# Altium project 超级电容.PrjPcb
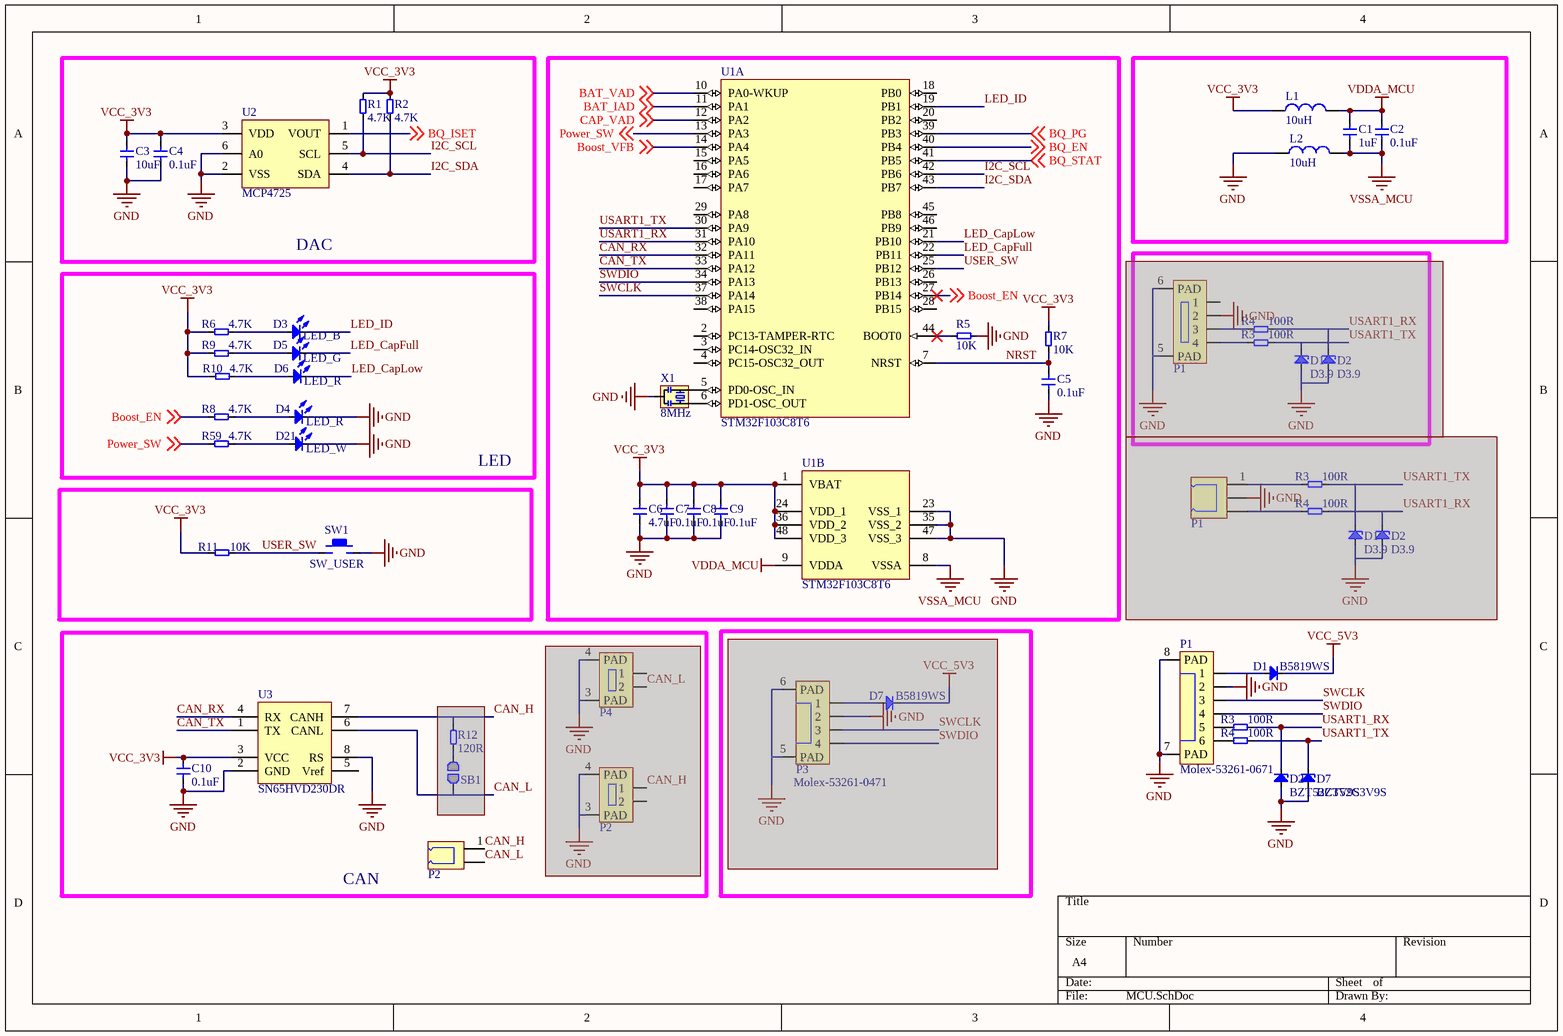
[diagram p0: MCU.SchDoc]
5 sheets, 188 parts. Net scope: global (net labels, ports and power ports of the same name join across sheets).
Board file: SCCM.PcbDoc
Sheets:
  MCU.SchDoc
  Power.SchDoc
  Buck.SchDoc
  PowerPath.SchDoc
  Boost.SchDoc

## Sheet MCU.SchDoc
size A4

### Parts
(Parts that share a designator on the sheet are numbered #1, #2 ... from top to bottom, then left to right.)
C1  1uF  [CAP-0603-L]
C2  0.1uF  [CAP-0603-L]
C3  10uF  [CAP-0805-L]
C4  0.1uF  [CAP-0603-L]
C5  0.1uF  [CAP-0603-L]
C6  4.7uF  [CAP-0603-L]
C7  0.1uF  [CAP-0603-L]
C8  0.1uF  [CAP-0603-L]
C9  0.1uF  [CAP-0603-L]
C10  0.1uF  [CAP-0603-L]
D1#1  D3.9  [SOD_323]  (masked out: inside a compile mask, not in the netlist)
D1#2  D3.9  [SOD_323]  (masked out: inside a compile mask, not in the netlist)
D1#3  B5819WS  [SOD_323]
D2#1  D3.9  [SOD_323]  (masked out: inside a compile mask, not in the netlist)
D2#2  D3.9  [SOD_323]  (masked out: inside a compile mask, not in the netlist)
D2#3  BZT52C3V9S  [SOD_323]
D3  LED_B  [LED_0603-L]
D4  LED_R  [LED_0603-L]
D5  LED_G  [LED_0603-L]
D6  LED_R  [LED_0603-L]
D7#1  B5819WS  [SOD_323]  (masked out: inside a compile mask, not in the netlist)
D7#2  BZT52C3V9S  [SOD_323]
D21  LED_W  [LED_0603-L]
L1  10uH  [L-0603-L]
L2  10uH  [L-0603-L]
P1#1  GH04  [SM04B-GHS-TB]  (value not drawn)  (masked out: inside a compile mask, not in the netlist)
P1#2  XH_3  [XH_3-sleep]  (value not drawn)  (masked out: inside a compile mask, not in the netlist)
P1#3  Molex-53261-0671  [Molex-53261-0671]
P2#1  GH02  [SM02B-GHS-TB]  (value not drawn)  (masked out: inside a compile mask, not in the netlist)
P2#2  XH_2  [XH_2-SLEEP]  (value not drawn)
P3  Molex-53261-0471  [Molex-53261-0471]  (masked out: inside a compile mask, not in the netlist)
P4  GH02  [SM02B-GHS-TB]  (value not drawn)  (masked out: inside a compile mask, not in the netlist)
R1  4.7K  [R-0603-L]
R2  4.7K  [R-0603-L]
R3#1  100R  [R-0603-L]  (masked out: inside a compile mask, not in the netlist)
R3#2  100R  [R-0603-L]  (masked out: inside a compile mask, not in the netlist)
R3#3  100R  [R-0603-L]
R4#1  100R  [R-0603-L]  (masked out: inside a compile mask, not in the netlist)
R4#2  100R  [R-0603-L]  (masked out: inside a compile mask, not in the netlist)
R4#3  100R  [R-0603-L]
R5  10K  [R-0603-L]
R6  4.7K  [R-0603-L]
R7  10K  [R-0603-L]
R8  4.7K  [R-0603-L]
R9  4.7K  [R-0603-L]
R10  4.7K  [R-0603-L]
R11  10K  [R-0603-L]
R12#1  120R  [R-0603-L]  (masked out: inside a compile mask, not in the netlist)
R59  4.7K  [R-0603-L]
SB1  Solderbridge  [Solderbridge-0603]  (value not drawn)  (no BOM)  (masked out: inside a compile mask, not in the netlist)
SW1  SW_USER  [KEY-4P-4.2*3.4*2.5]
U1  STM32F103C8T6  [STM-LQFP48_N]  (parts A,B of 2)
U2  MCP4725  [SOT-23-6]
U3  SN65HVD230DR  [SOIC_8]
X1  8MHz  [CSTCE_G(A)村田晶振]

### Blocks framed on the sheet
DAC: C3 C4 R1 R2 U2
LED: D3-D6 D21 R6 R8-R10 R59
CAN: C10 P2#1 P2#2 P4 R12#1 SB1 U3

### Nets
GND: C3.1 C4.1 C5.1 C6.1 C7.1 C8.1 C9.1 C10.1 D2#3.1 D4.2 D7#2.1 D21.2 L2.1 P1#3.2 P1#3.7(PAD) P1#3.8(PAD) R5.2 SW1.1 U1.23(VSS_1) U1.35(VSS_2) U1.47(VSS_3) U2.2(VSS) U2.6(A0) U3.2(GND) U3.8(RS) X1.2(GND)
VCC_3V3: C3.2 C4.2 C6.2 C7.2 C8.2 C9.2 C10.2 L1.1 R1.2 R2.2 R6.1 R7.2 R9.1 R10.1 R11.1 U1.1(VBAT) U1.24(VDD_1) U1.36(VDD_2) U1.48(VDD_3) U2.3(VDD) U3.3(VCC)
VCC_5V3: D1#3.2
VDDA_MCU: C1.2 C2.2 L1.2 U1.9(VDDA)
VSSA_MCU: C1.1 C2.1 L2.2 U1.8(VSSA)
BAT_IAD: U1.11(PA1) ; off-sheet BAT_IAD
BAT_VAD: U1.10(PA0-WKUP) ; off-sheet BAT_VAD
Boost_EN: R8.1 U1.27(PB14) ; off-sheet Boost_EN
Boost_VFB: U1.14(PA4) ; off-sheet Boost_VFB  [project net LM_VFB]
BQ_EN: U1.40(PB4) ; off-sheet BQ_EN
BQ_ISET: U2.1(VOUT) ; off-sheet BQ_ISET
BQ_PG: U1.39(PB3) ; off-sheet BQ_PG
BQ_STAT: U1.41(PB5) ; off-sheet BQ_STAT
CAN_H: P2#2.1 U3.7(CANH)
CAN_L: P2#2.2 U3.6(CANL)
CAN_RX: U1.32(PA11) U3.4(RX)
CAN_TX: U1.33(PA12) U3.1(TX)
CAP_VAD: U1.12(PA2) ; off-sheet CAP_VAD
I2C_SCL: R1.1 U1.42(PB6) U2.5(SCL)
I2C_SDA: R2.1 U1.43(PB7) U2.4(SDA)
LED_CapFull: D5.2 U1.22(PB11)
LED_CapLow: D6.2 U1.21(PB10)
LED_ID: D3.2 U1.19(PB1)
NRST: C5.2 R7.1 U1.7(NRST)
Power_SW: R59.1 U1.13(PA3) ; off-sheet Power_SW
SWCLK: P1#3.3 U1.37(PA14)
SWDIO: P1#3.4 U1.34(PA13)
USART1_RX: D2#3.2 R3#3.2 U1.31(PA10)
USART1_TX: D7#2.2 R4#3.2 U1.30(PA9)
USER_SW: R11.2 SW1.2 U1.25(PB12)
NetD1#3_1: D1#3.1 P1#3.1
NetD3_1: D3.1 R6.2
NetD4_1: D4.1 R8.2
NetD5_1: D5.1 R9.2
NetD6_1: D6.1 R10.2
NetD21_1: D21.1 R59.2
NetP1#3_5: P1#3.5 R3#3.1
NetP1#3_6: P1#3.6 R4#3.1
NetR5_1: R5.1 U1.44(BOOT0)
NetU1_5: U1.5(PD0-OSC_IN) X1.1(OSC1)
NetU1_6: U1.6(PD1-OSC_OUT) X1.3(OSC2)

Not connected (* = marked no-connect by the designer): U1 2(PC13-TAMPER-RTC) 3(PC14-OSC32_IN) 4(PC15-OSC32_OUT) 15(PA5) 16(PA6) 17(PA7) 18(PB0) 20(PB2) 26(PB13) 28(PB15) 29(PA8) 38(PA15) 45(PB8) 46(PB9); U3 5(Vref)

### Library data of the parts
C1-C10 = CAP
D1#1 D1#2 D2#1-D2#3 D7#2 = Diode_ZD
D1#3 D7#1 = Diode
D3-D6 D21 = LED
L1 L2 = Inductor: 电感
P1#1 = GHS-M04B: 04GH座
P1#3 = Molex-53261-0671: 1.25mm Pitch PicoBlade Header
P2#1 P4 = GHS-M02B: 02GH座
P3 = Molex-53261-0471: 1.25mm Pitch PicoBlade Header
R1 R2 R3#1-R3#3 R4#1-R4#3 R5-R11 R12#1 R59 = Res
SW1 = KEY
U1 = STM32F103C8T6: ARM Cortex-M3 32-bit MCU, 64 KB Flash, 20 KB Internal RAM, 37 I/Os, 48-pin LQFP, -40 to 85 degC, Tray; A/D Converter: 2x12-bit (10 Channel); FLASH Size (Prog) (kB): 64; I/Os (High Current): 37; Internal RAM Size (kB): 20; Operating Frequency(F) (Processor speed) (MHz): 72; Supply Voltage(Vcc) min (V): 2; DatasheetVersion: Rev. 16; PackageVersion: Rev. 6, 06/2013; PackageReference: LQFP48; PackageDescription: 48-Pin Low Profile Quad Flat Package, 7 x 7 mm Body, 0.5 mm Pitch; Supplier 1: Digi-Key; Supplier Part Number 1: 497-6063-ND; Supplier 2: Farnell; Supplier Part Number 2: 1447637; Supplier 3: Newark; Supplier Part Number 3: 59M2182; Supplier 4: Newark; Supplier Part Number 4: 57P1222; Supplier 5: Mouser; Supplier Part Number 5: 511-STM32F103C8T6; Core: ARM Cortex-M3; Packing: Tray; Mounting Technology: Surface Mount; PartNumber: STM32F103C8T6; ComponentLink1Description: Manufacturer URL; ComponentLink1URL: http://www.st.com/web/en/home.html; ComponentLink2Description: Datasheet; ComponentLink2URL: http://www.st.com/st-web-ui/static/active/en/resource/technical/document/datasheet/CD00161566.pdf; ComponentLink3Description: Package Specification; ComponentLink3URL: http://www.st.com/st-web-ui/static/active/en/resource/technical/document/datasheet/DM00058181.pdf
U2 = MCP4725: I2C 12bit DAC
U3 = SN65HVD230DR: CAN芯片
X1 = XTAL-3215
SB1 = Solderbridge: Value: Solderbridge

## Sheet Power.SchDoc
size A4
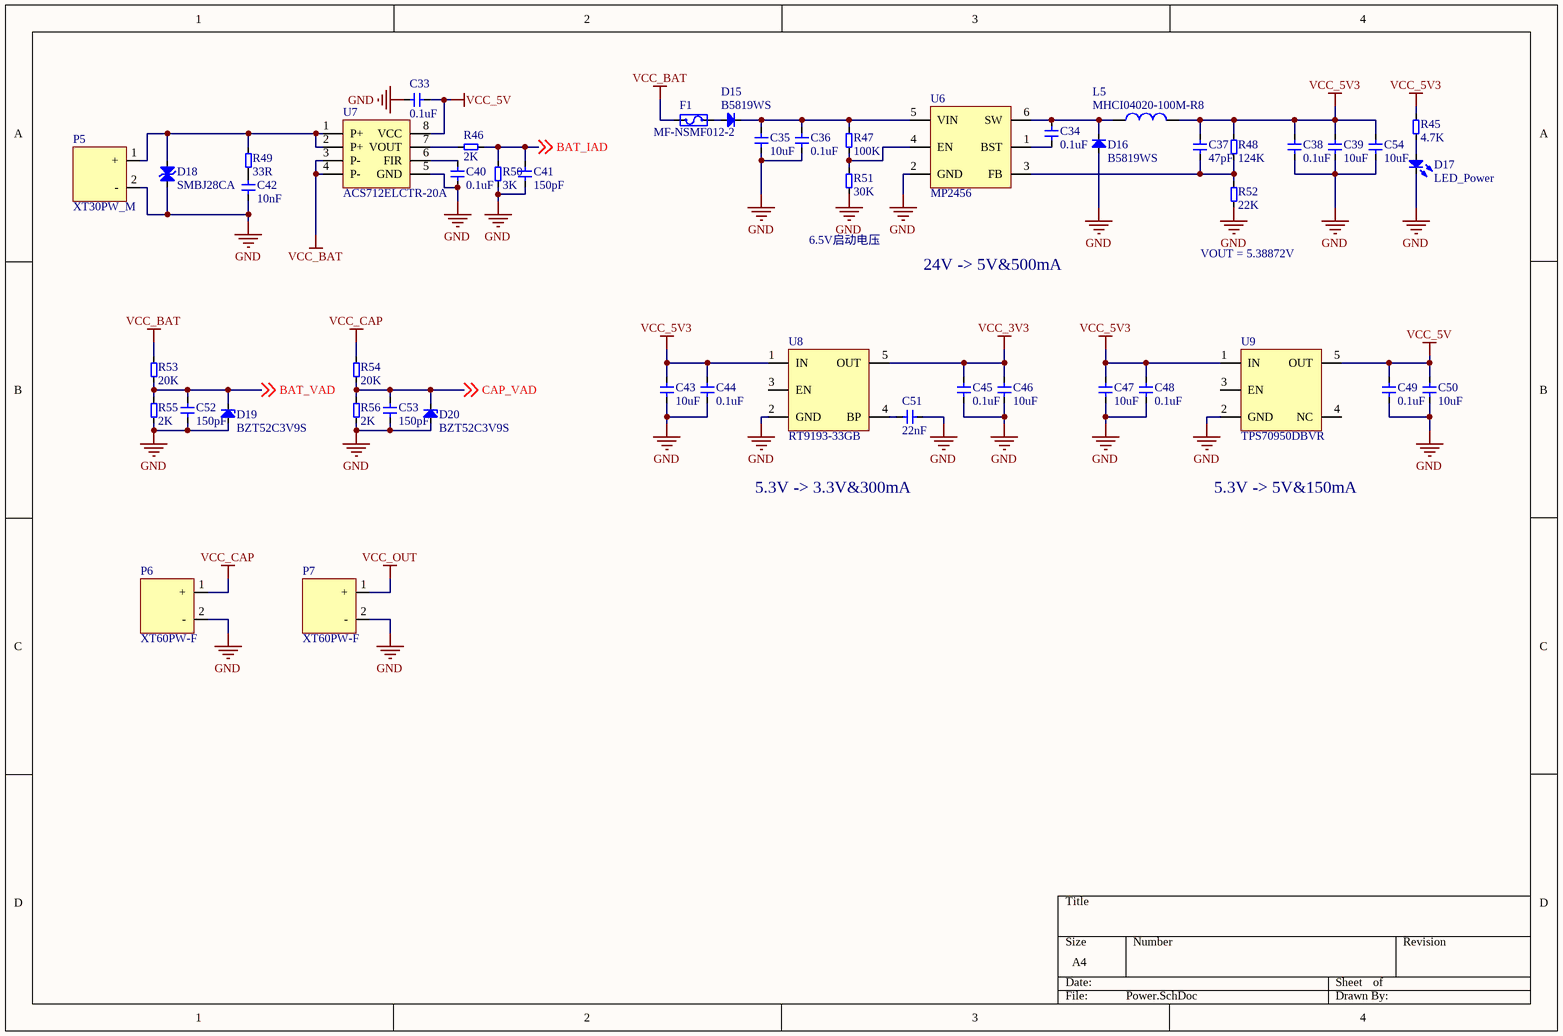
[diagram p1: Power.SchDoc]

### Parts
C33  0.1uF  [CAP-0603-L]
C34  0.1uF  [CAP-0603-L]
C35  10uF  [CAP-0805-L]
C36  0.1uF  [CAP-0603-L]
C37  47pF  [CAP-0603-L]
C38  0.1uF  [CAP-0603-L]
C39  10uF  [CAP-0805-L]
C40  0.1uF  [CAP-0603-L]
C41  150pF  [CAP-0603-L]
C42  10nF  [CAP-0805-L]
C43  10uF  [CAP-0805-L]
C44  0.1uF  [CAP-0603-L]
C45  0.1uF  [CAP-0603-L]
C46  10uF  [CAP-0805-L]
C47  10uF  [CAP-0805-L]
C48  0.1uF  [CAP-0603-L]
C49  0.1uF  [CAP-0603-L]
C50  10uF  [CAP-0805-L]
C51  22nF  [CAP-0603-L]
C52  150pF  [CAP-0603-L]
C53  150pF  [CAP-0603-L]
C54  10uF  [CAP-0805-L]
D15  B5819WS  [SOD_323]
D16  B5819WS  [SOD_323]
D17  LED_Power  [LED_0603-L]
D18  SMBJ28CA  [Diode_SMA]
D19  BZT52C3V9S  [SOD_323]
D20  BZT52C3V9S  [SOD_323]
F1  MF-NSMF012-2  [FUSE_1206]
L5  MHCI04020-100M-R8  [L-0420]
P5  XT30PW_M  [XT30PW-M]
P6  XT60PW-F  [XT60PW-M]
P7  XT60PW-F  [XT60PW-F]
R45  4.7K  [R-0603-L]
R46  2K  [R-0603-L]
R47  100K  [R-0603-L]
R48  124K  [R-0603-L]
R49  33R  [R-0805-L]
R50  3K  [R-0603-L]
R51  30K  [R-0603-L]
R52  22K  [R-0603-L]
R53  20K  [R-0603-L]
R54  20K  [R-0603-L]
R55  2K  [R-0603-L]
R56  2K  [R-0603-L]
U6  MP2456  [SOT-23-6]
U7  ACS712ELCTR-20A  [SOIC_8]
U8  RT9193-33GB  [SOT-23-5]
U9  TPS70950DBVR  [SOT-23-5]

### Nets
GND: C33.2 C35.1 C36.1 C38.1 C39.1 C40.1 C41.1 C42.1 C43.1 C44.1 C45.1 C46.1 C47.1 C48.1 C49.1 C50.1 C51.1 C52.1 C53.1 C54.1 D16.1 D17.2 D18.1 D19.1 D20.1 P5.2(-) P6.2(-) P7.2(-) R50.1 R51.1 R52.1 R55.1 R56.1 U6.2(GND) U7.5(GND) U8.2(GND) U9.2(GND)
VCC_3V3: C45.2 C46.2 U8.5(OUT)
VCC_5V: C33.1 C49.2 C50.2 U7.8(VCC) U9.5(OUT)
VCC_5V3: C37.2 C38.2 C39.2 C43.2 C44.2 C47.2 C48.2 C54.2 L5.2 R45.2 R48.2 U8.1(IN) U9.1(IN)
VCC_BAT: F1.1 R53.2 U7.3(P-) U7.4(P-)
VCC_CAP: P6.1(+) R54.2
VCC_OUT: P7.1(+)
BAT_IAD: C41.2 R46.1 R50.2 ; off-sheet BAT_IAD
BAT_VAD: C52.2 D19.2 R53.1 R55.2 ; off-sheet BAT_VAD
CAP_VAD: C53.2 D20.2 R54.1 R56.2 ; off-sheet CAP_VAD
NetC34_1: C34.1 U6.1(BST)
NetC34_2: C34.2 D16.2 L5.1 U6.6(SW)
NetC35_2: C35.2 C36.2 D15.2 R47.2 U6.5(VIN)
NetC37_1: C37.1 R48.1 R52.2 U6.3(FB)
NetC40_2: C40.2 U7.6(FIR)
NetC42_2: C42.2 R49.1
NetC51_2: C51.2 U8.4(BP)
NetD15_1: D15.1 F1.2
NetD17_1: D17.1 R45.1
NetD18_2: D18.2 P5.1(+) R49.2 U7.1(P+) U7.2(P+)
NetR46_2: R46.2 U7.7(VOUT)
NetR47_1: R47.1 R51.2 U6.4(EN)

Not connected (* = marked no-connect by the designer): U8 3(EN); U9 3(EN) 4(NC)

### Notes on the sheet
- (near R51) 6.5V启动电压
- 24V -> 5V&500mA
- (near R52) VOUT = 5.38872V
- 5.3V -> 3.3V&300mA
- 5.3V -> 5V&150mA

### Library data of the parts
C33-C54 = CAP
D15 D16 = Diode
D17 = LED
D18 = TVS_C
D19 D20 = Diode_ZD
F1 = Fuse
L5 = Inductor: 电感
P5 = XT30
P6 P7 = XT60
R45-R56 = Res
U7 = ACS712ELCTR: 电流测量芯片
U8 = RT9193: LDO
U9 = TPS709: 具有使能端的 150-mA 超低 Iq LDO

## Sheet Buck.SchDoc
size A4
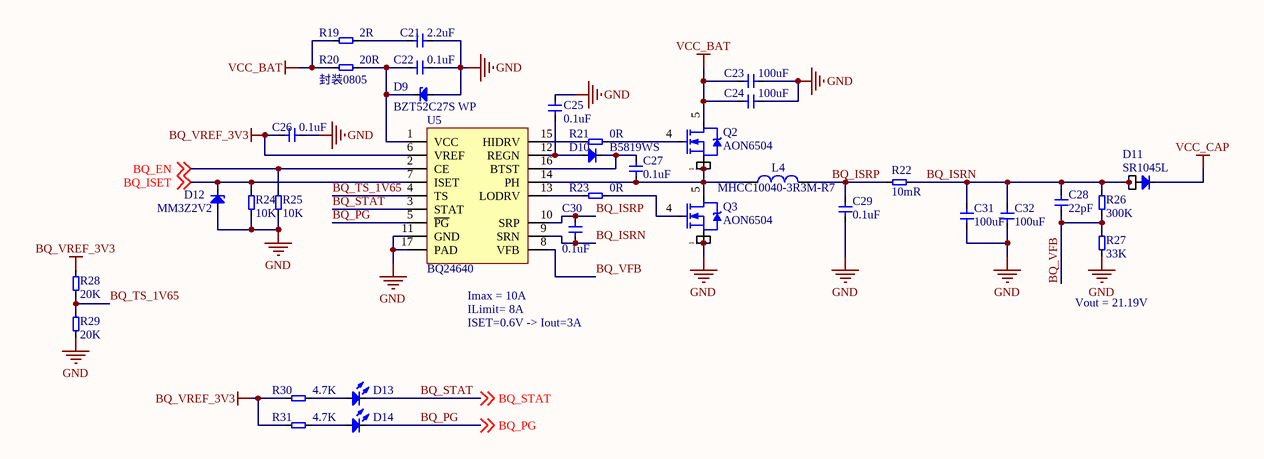
[diagram p2: Buck.SchDoc]

### Parts
C21  2.2uF  [CAP-0603-L]
C22  0.1uF  [CAP-0603-L]
C23  100uF  [CAP-1206-L]
C24  100uF  [CAP-1206-L]
C25  0.1uF  [CAP-0603-L]
C26  0.1uF  [CAP-0603-L]
C27  0.1uF  [CAP-0603-L]
C28  22pF  [CAP-0603-L]
C29  0.1uF  [CAP-0603-L]
C30  0.1uF  [CAP-0603-L]
C31  100uF  [CAP-1206-L]
C32  100uF  [CAP-1206-L]
D9  BZT52C27S WP  [SOD_323]
D10  B5819WS  [SOD_323]
D11  SR1045L  [PowerDi-5]
D12  MM3Z2V2  [SOD_323]
D13  LED_B  [LED_0603-L]  (value not drawn)
D14  LED_G  [LED_0603-L]  (value not drawn)
L4  MHCC10040-3R3M-R7  [L-10040]
Q2  AON6504  [DFN5x6]
Q3  AON6504  [DFN5x6]
R19  2R  [R-0603-L]
R20  20R  [R-0805-L]
R21  0R  [R-0603-L]
R22  10mR  [R-2512-SMALL]
R23  0R  [R-0603-L]
R24  10K  [R-0603-L]
R25  10K  [R-0603-L]
R26  300K  [R-0603-L]
R27  33K  [R-0603-L]
R28  20K  [R-0603-L]
R29  20K  [R-0603-L]
R30  4.7K  [R-0603-L]
R31  4.7K  [R-0603-L]
U5  BQ24640  [VQFN16N]

### Nets
BQ_VREF_3V3: C26.1 R28.2 R30.1 R31.1 U5.6(VREF)
GND: C21.2 C22.2 C23.1 C24.1 C25.2 C26.2 C29.1 C31.1 C32.1 D9.1 D12.1 Q3.1(S) Q3.2(S) Q3.3(S) R24.1 R25.1 R27.1 R29.1 U5.11(GND) U5.17(PAD)
VCC_BAT: C23.2 C24.2 Q2.5(D) R19.1 R20.1
VCC_CAP: D11.3
BQ_EN: R25.2 U5.2(CE) ; off-sheet BQ_EN
BQ_ISET: D12.2 R24.2 U5.7(ISET) ; off-sheet BQ_ISET
BQ_ISRN: C28.2 C30.1 C31.2 C32.2 D11.1 D11.2 R22.2 R26.2 U5.9(SRN)
BQ_ISRP: C29.2 C30.2 L4.2 R22.1 U5.10(SRP)
BQ_PG: D14.2 U5.5(~{PG}) ; off-sheet BQ_PG
BQ_STAT: D13.2 U5.3(STAT) ; off-sheet BQ_STAT
BQ_TS_1V65: R28.1 R29.2 U5.4(TS)
BQ_VFB: C28.1 R26.1 R27.2 U5.8(VFB)
NetC21_1: C21.1 R19.2
NetC22_1: C22.1 D9.2 R20.2 U5.1(VCC)
NetC25_1: C25.1 D10.1 U5.12(REGN)
NetC27_1: C27.1 L4.1 Q2.1(S) Q2.2(S) Q2.3(S) Q3.5(D) U5.14(PH)
NetC27_2: C27.2 D10.2 U5.16(BTST)
NetD13_1: D13.1 R30.2
NetD14_1: D14.1 R31.2
NetQ2_4: Q2.4(G) R21.2
NetQ3_4: Q3.4(G) R23.2
NetR21_1: R21.1 U5.15(HIDRV)
NetR23_1: R23.1 U5.13(LODRV)

### Notes on the sheet
- (near R20) 封装0805
- (near U5) Imax = 10A
- (near R27) Vout = 21.19V
- ILimit= 8A
- ISET=0.6V -> Iout=3A

### Library data of the parts
C21-C32 = CAP
D9 D12 = Diode_ZD
D10 = Diode
D11 = Diode_1
D13 D14 = LED
L4 = Inductor: 电感
Q2 Q3 = MOS-N_1
R19-R31 = Res
U5 = BQ24640: 用于超级电容器的高效同步开关模式电池充电控制器

## Sheet PowerPath.SchDoc
size A4
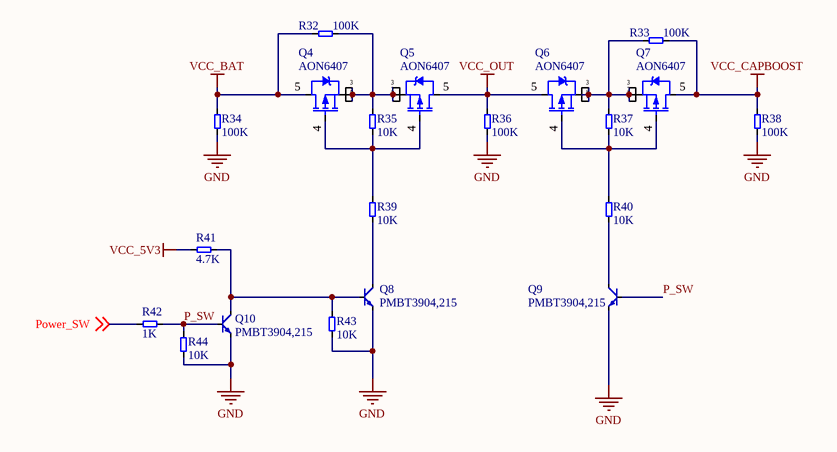
[diagram p3: PowerPath.SchDoc]

### Parts
Q4  AON6407  [DFN5x6]
Q5  AON6407  [DFN5x6]
Q6  AON6407  [DFN5x6]
Q7  AON6407  [DFN5x6]
Q8  PMBT3904,215  [SOT-23-3]
Q9  PMBT3904,215  [SOT-23-3]
Q10  PMBT3904,215  [SOT-23-3]
R32  100K  [R-0603-L]
R33  100K  [R-0603-L]
R34  100K  [R-0603-L]
R35  10K  [R-0603-L]
R36  100K  [R-0603-L]
R37  10K  [R-0603-L]
R38  100K  [R-0603-L]
R39  10K  [R-0603-L]
R40  10K  [R-0603-L]
R41  4.7K  [R-0603-L]
R42  1K  [R-0603-L]
R43  10K  [R-0603-L]
R44  10K  [R-0603-L]

### Nets
GND: Q8.2(E) Q9.2(E) Q10.2(E) R34.1 R36.1 R38.1 R43.2 R44.2
VCC_5V3: R41.2
VCC_BAT: Q4.5(D) R32.2 R34.2
VCC_CAPBOOST: Q7.5(D) R33.1 R38.2
VCC_OUT: Q5.5(D) Q6.5(D) R36.2
P_SW: Q9.1(B) Q10.1(B) R42.2 R44.1
Power_SW: R42.1 ; off-sheet Power_SW
NetQ4_1: Q4.1(S) Q4.2(S) Q4.3(S) Q5.1(S) Q5.2(S) Q5.3(S) R32.1 R35.2
NetQ4_4: Q4.4(G) Q5.4(G) R35.1 R39.2
NetQ6_1: Q6.1(S) Q6.2(S) Q6.3(S) Q7.1(S) Q7.2(S) Q7.3(S) R33.2 R37.2
NetQ6_4: Q6.4(G) Q7.4(G) R37.1 R40.2
NetQ8_1: Q8.1(B) Q10.3(C) R41.1 R43.1
NetQ8_3: Q8.3(C) R39.1
NetQ9_3: Q9.3(C) R40.1

### Library data of the parts
Q4-Q7 = MOS-P_1
Q8-Q10 = BJT_NPN: Transistor
R32-R44 = Res

## Sheet Boost.SchDoc
size A4
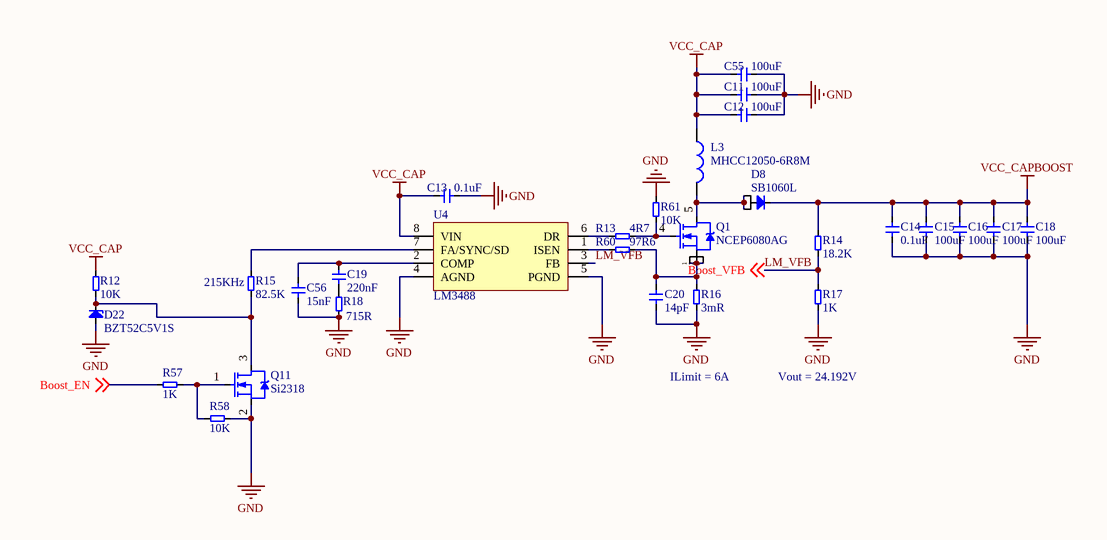
[diagram p4: Boost.SchDoc]

### Parts
(Parts that share a designator on the sheet are numbered #1, #2 ... from top to bottom, then left to right.)
C11  100uF  [CAP-1206-L]
C12  100uF  [CAP-1206-L]
C13  0.1uF  [CAP-0603-L]
C14  0.1uF  [CAP-0603-L]
C15  100uF  [CAP-1206-L]
C16  100uF  [CAP-1206-L]
C17  100uF  [CAP-1206-L]
C18  100uF  [CAP-1206-L]
C19  220nF  [CAP-0603-L]
C20  14pF  [CAP-0603-L]
C55  100uF  [CAP-1206-L]
C56  15nF  [CAP-0603-L]
D8  SB1060L  [PowerDi-5]
D22  BZT52C5V1S  [SOD_323]
L3  MHCC12050-6R8M  [L-12560]
Q1  NCEP6080AG  [DFN5x6]
Q11  Si2318  [SOT-23-3]
R12#2  10K  [R-0603-L]
R13  4R7  [R-0603-L]
R14  18.2K  [R-0603-L]
R15  82.5K  [R-0603-L]
R16  3mR  [R-2512-SMALL]
R17  1K  [R-0603-L]
R18  715R  [R-0603-L]
R57  1K  [R-0603-L]
R58  10K  [R-0603-L]
R60  97R6  [R-0603-L]
R61  10K  [R-0603-L]
U4  LM3488  [MSOP_E120_P0.5_10]

### Nets
GND: C11.1 C12.1 C13.1 C14.1 C15.1 C16.1 C17.1 C18.1 C20.1 C55.1 C56.1 D22.1 Q11.2(S) R16.1 R17.1 R18.1 R58.1 R61.1 U4.4(AGND) U4.5(PGND)
VCC_CAP: C11.2 C12.2 C13.2 C55.2 L3.1 R12#2.1 U4.8(VIN)
VCC_CAPBOOST: C14.2 C15.2 C16.2 C17.2 C18.2 D8.3 R14.2
Boost_EN: R57.2 ; off-sheet Boost_EN
LM_VFB: R14.1 R17.2 U4.3(FB) ; off-sheet Boost_VFB  [also labelled Boost_VFB]
NetC19_1: C19.1 R18.2
NetC19_2: C19.2 C56.2 U4.2(COMP)
NetC20_2: C20.2 Q1.1(S) Q1.2(S) Q1.3(S) R16.2 R60.1
NetD8_1: D8.1 D8.2 L3.2 Q1.5(D)
NetD22_2: D22.2 Q11.3(D) R12#2.2 R15.1
NetQ1_4: Q1.4(G) R13.1 R61.2
NetQ11_1: Q11.1(G) R57.1 R58.2
NetR13_2: R13.2 U4.6(DR)
NetR15_2: R15.2 U4.7(FA/SYNC/SD)
NetR60_2: R60.2 U4.1(ISEN)

### Notes on the sheet
- (near R15) 215KHz
- ILimit = 6A
- Vout = 24.192V

### Library data of the parts
C11-C20 C55 C56 = CAP
D8 = Diode_1
D22 = Diode_ZD
L3 = Inductor: 电感
Q1 = MOS-N_1
Q11 = MOS-N
R12#2 R13-R18 R57 R58 R60 R61 = Res
U4 = LM3488: Automotive High-Efficiency Controller for Boost, SEPIC and Fly-Back DC-DCConverters

## Nets that join several sheets
GND: MCU (26 pins), Power (37 pins), Buck (20 pins), PowerPath (8 pins), Boost (20 pins)
VCC_3V3: MCU (21 pins), Power (C45.2 C46.2 U8.5)
VCC_5V3: MCU (D1#3.2), Power (13 pins), PowerPath (R41.2)
VCC_BAT: Power (F1.1 R53.2 U7.3 U7.4), Buck (5 pins), PowerPath (Q4.5 R32.2 R34.2)
VCC_CAP: Power (P6.1 R54.2), Buck (D11.3), Boost (7 pins)
VCC_CAPBOOST: PowerPath (Q7.5 R33.1 R38.2), Boost (7 pins)
VCC_OUT: Power (P7.1), PowerPath (Q5.5 Q6.5 R36.2)
BAT_IAD: MCU (U1.11), Power (C41.2 R46.1 R50.2)
BAT_VAD: MCU (U1.10), Power (C52.2 D19.2 R53.1 R55.2)
Boost_EN: MCU (R8.1 U1.27), Boost (R57.2)
BQ_EN: MCU (U1.40), Buck (R25.2 U5.2)
BQ_ISET: MCU (U2.1), Buck (D12.2 R24.2 U5.7)
BQ_PG: MCU (U1.39), Buck (D14.2 U5.5)
BQ_STAT: MCU (U1.41), Buck (D13.2 U5.3)
CAP_VAD: MCU (U1.12), Power (C53.2 D20.2 R54.1 R56.2)
LM_VFB: MCU (U1.14), Boost (R14.1 R17.2 U4.3)
Power_SW: MCU (R59.1 U1.13), PowerPath (R42.1)